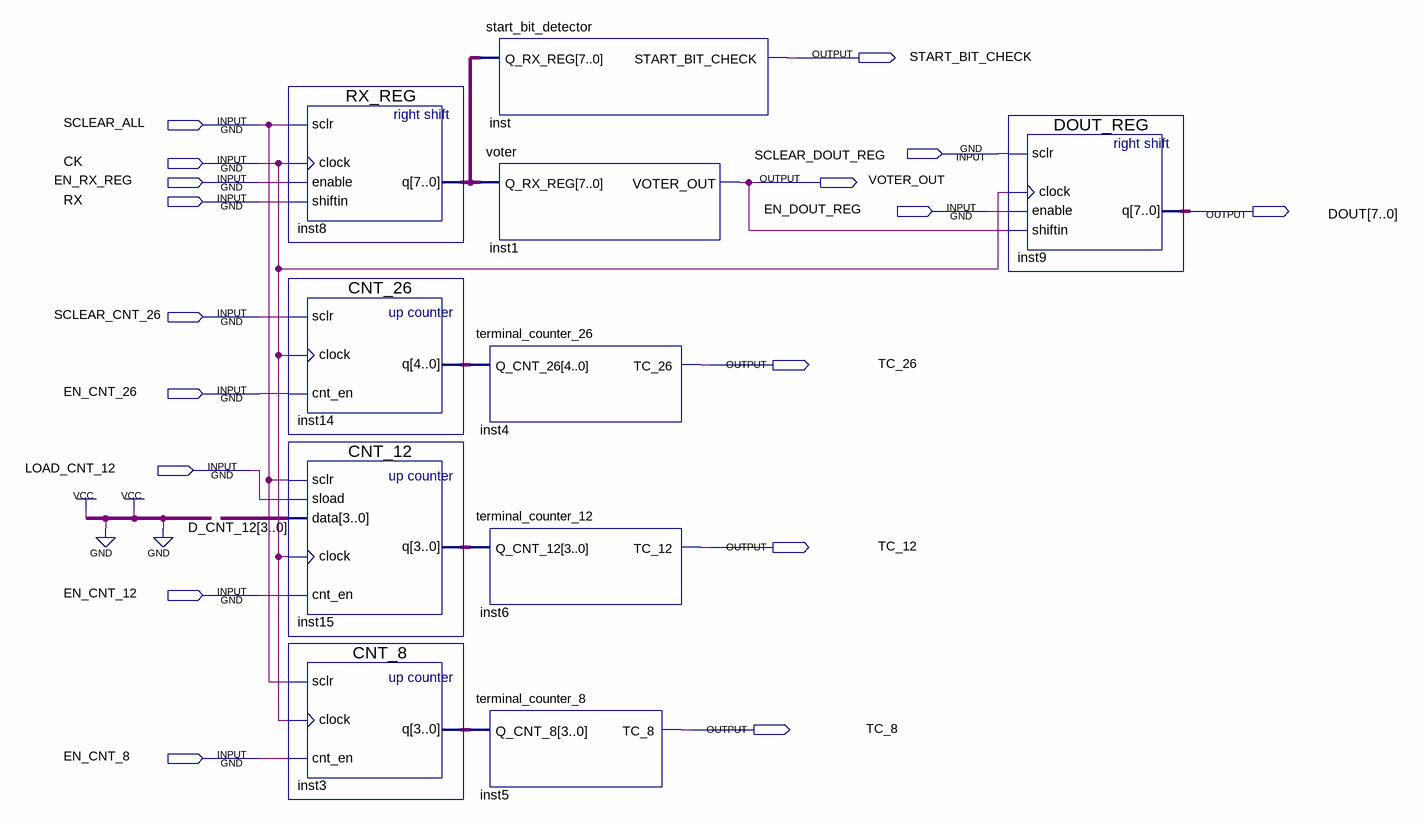
[diagram p0: schematic sheet]
// Quartus schematic uartRX_DP.bdf as structural Verilog: 10 symbols, 17 pins
module uartRX_DP (
  input  SCLEAR_ALL,
  input  SCLEAR_DOUT_REG,
  input  CK,
  input  EN_RX_REG,
  input  RX,
  input  EN_DOUT_REG,
  input  SCLEAR_CNT_26,
  input  EN_CNT_26,
  input  LOAD_CNT_12,
  input  EN_CNT_12,
  input  EN_CNT_8,
  output START_BIT_CHECK,
  output VOTER_OUT,
  output [7:0] DOUT,
  output TC_26,
  output TC_12,
  output TC_8
);

  wire [3:0] Q_CNT_8, Q_CNT_12;
  wire [4:0] inst14_q;
  wire [7:0] inst8_q;

  RX_REG inst8 (.sclr(SCLEAR_ALL), .clock(CK), .enable(EN_RX_REG), .shiftin(RX), .q(inst8_q));
  CNT_26 inst14 (.sclr(SCLEAR_CNT_26), .clock(CK), .cnt_en(EN_CNT_26), .q(inst14_q));
  CNT_12 inst15 (.sclr(SCLEAR_ALL), .sload(LOAD_CNT_12), .data(4'b0101), .clock(CK), .cnt_en(EN_CNT_12), .q(Q_CNT_12));
  CNT_8 inst3 (.sclr(SCLEAR_ALL), .clock(CK), .cnt_en(EN_CNT_8), .q(Q_CNT_8));
  start_bit_detector inst (.Q_RX_REG(inst8_q), .START_BIT_CHECK(START_BIT_CHECK));
  voter inst1 (.Q_RX_REG(inst8_q), .VOTER_OUT(VOTER_OUT));
  terminal_counter_26 inst4 (.Q_CNT_26(inst14_q), .TC_26(TC_26));
  terminal_counter_12 inst6 (.Q_CNT_12(Q_CNT_12), .TC_12(TC_12));
  terminal_counter_8 inst5 (.Q_CNT_8(Q_CNT_8), .TC_8(TC_8));
  DOUT_REG inst9 (.sclr(SCLEAR_DOUT_REG), .clock(CK), .enable(EN_DOUT_REG), .shiftin(VOTER_OUT), .q(DOUT));
endmodule
